# Altium project P3_MP3_Player.PrjPcb (part 2 of 2)

## Sheet 04_Audio.SchDoc
size A4; SheetNumber: 4; SheetTotal: 6
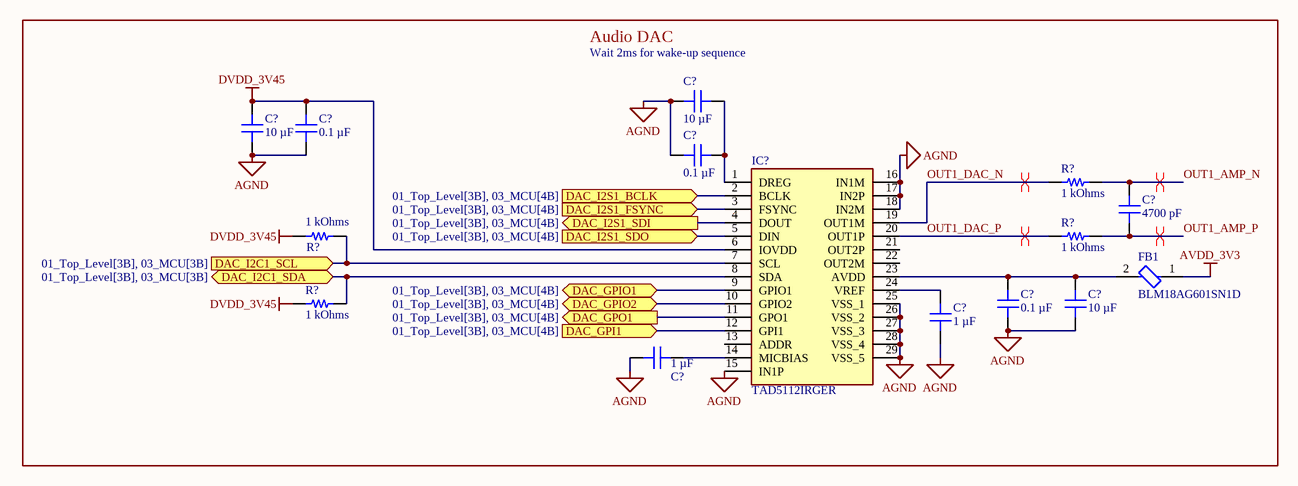
[diagram p4: 04_Audio.SchDoc]

### Parts
(Parts that share a designator on the sheet are numbered #1, #2 ... from top to bottom, then left to right.)
C?#9  10 µF  [CAP 0805_2012]
C?#10  10 µF  [CAP 0805_2012]
C?#11  0.1 µF  [CAP 0402_1005]
C?#12  0.1 µF  [CAP 0402_1005]
C?#13  4700 pF  [CAP 0402_1005]
C?#14  0.1 µF  [CAP 0402_1005]
C?#15  10 µF  [CAP 0805_2012]
C?#16  1 µF  [CAP 0603_1608]
C?#17  1 µF  [CAP 0603_1608]
FB1  BLM18AG601SN1D  [FP-BLM18-0_15-t0_8-MFG]
IC?#2  TAD5112IRGER  [TAD5112IRGER]
R?#3  1 kOhms  [RES 0402_1005]
R?#4  1 kOhms  [RES 0402_1005]
R?#5  1 kOhms  [RES 0402_1005]
R?#6  1 kOhms  [RES 0402_1005]

### Ports
DAC_GPI1 (in, see 01_Top_Level[3B], 03_MCU[4B]), DAC_GPIO1 (bidir, see 01_Top_Level[3B], 03_MCU[4B]), DAC_GPIO2 (bidir, see 01_Top_Level[3B], 03_MCU[4B]), DAC_GPO1 (out, see 01_Top_Level[3B], 03_MCU[4B]), DAC_I2C1_SCL (in, see 01_Top_Level[3B], 03_MCU[3B]), DAC_I2C1_SDA (bidir, see 01_Top_Level[3B], 03_MCU[3B]), DAC_I2S1_BCLK (in, see 01_Top_Level[3B], 03_MCU[4B]), DAC_I2S1_FSYNC (in, see 01_Top_Level[3B], 03_MCU[4B]), DAC_I2S1_SDI (out, see 01_Top_Level[3B], 03_MCU[4B]), DAC_I2S1_SDO (in, see 01_Top_Level[3B], 03_MCU[4B])

### Nets
AGND: C?#9.2 C?#10.2 C?#11.1 C?#12.1 C?#14.1 C?#15.2 C?#16.1 C?#17.2 IC?#2.15(IN1P) IC?#2.16(IN1M) IC?#2.17(IN2P) IC?#2.18(IN2M) IC?#2.25(VSS_1) IC?#2.26(VSS_2) IC?#2.27(VSS_3) IC?#2.28(VSS_4) IC?#2.29(VSS_5)
AVDD_3V3: FB1.1
DVDD_3V45: C?#10.1 C?#11.2 IC?#2.6(IOVDD) R?#4.2 R?#6.2
OUT1_AMP_N: C?#13.2 R?#3.2
OUT1_AMP_P: C?#13.1 R?#5.2
OUT1_DAC_N: IC?#2.19(OUT1M) R?#3.1
OUT1_DAC_P: IC?#2.20(OUT1P) R?#5.1
NetC?#9_1: C?#9.1 C?#12.2 IC?#2.1(DREG)
NetC?#14_2: C?#14.2 C?#15.1 FB1.2 IC?#2.23(AVDD)
NetC?#16_2: C?#16.2 IC?#2.24(VREF)
NetC?#17_1: C?#17.1 IC?#2.14(MICBIAS)
NetIC?#1_50: IC?#2.3(FSYNC) ; port DAC_I2S1_FSYNC
NetIC?#1_51: IC?#2.12(GPI1) ; port DAC_GPI1
NetIC?#1_52: IC?#2.11(GPO1) ; port DAC_GPO1
NetIC?#1_53: IC?#2.10(GPIO2) ; port DAC_GPIO2
NetIC?#1_54: IC?#2.9(GPIO1) ; port DAC_GPIO1
NetIC?#1_55: IC?#2.2(BCLK) ; port DAC_I2S1_BCLK
NetIC?#1_56: IC?#2.4(DOUT) ; port DAC_I2S1_SDI
NetIC?#1_57: IC?#2.5(DIN) ; port DAC_I2S1_SDO
NetIC?#1_61: IC?#2.7(SCL) R?#4.1 ; port DAC_I2C1_SCL
NetIC?#1_62: IC?#2.8(SDA) R?#6.1 ; port DAC_I2C1_SDA

Not connected (* = marked no-connect by the designer): IC?#2 13(ADDR) 21(OUT2P) 22(OUT2M)

### Layout directives
differential pair: OUT1_AMP_N, OUT1_AMP_P, OUT1_DAC_N, OUT1_DAC_P

### Notes on the sheet
- Audio DAC
- (near C?#9) Wait 2ms for wake-up sequence

### Library data of the parts
C?#9 C?#10 C?#15 = CL21A106KOQNNNG: CAP CER 10UF 16V X5R 0805; manufacturer: Samsung Electro-Mechanics; Tolerance: ±10%; Part Number: CL21A106KOQNNNG; Capacitance: 10 µF; Applications: General Purpose; componentlink1description: Datasheet; componentlink1url: http://www.samsungsem.com/kr/support/product-search/mlcc/CL21A106KOQNNNG.jsp; componentlink2description: DigiKey Link; componentlink2url: https://www.digikey.com/en/products/detail/samsung-electro-mechanics/CL21A106KOQNNNG/3894417; Device Package: 0805 (2012 Metric); lastupdated: 4/6/2026 7:33:06 PM; Lifecycle Status: Active; Minimum Order: 1; Mounting Type: Surface Mount, MLCC; Operating Temperature: -55°C ~ 85°C; Package / Case: 0805 (2012 Metric); packaging: TapeAndReel; partid: 39874; Part Status: Active; price: 0.01; series: CL; Size / Dimension: 0.079" L x 0.049" W (2.00mm x 1.25mm); Supplier 1: DigiKey; Supplier Part Number 1: 1276-6455-1-ND; Temperature Coefficient: X5R; Thickness (Max): 0.055" (1.40mm); value: 10 µF; Voltage - Rated: 16V
C?#11 C?#12 C?#14 = EMF105B7104KVHF: CAP CER 0.1UF 16V X7R 0402; manufacturer: Taiyo Yuden; Tolerance: ±10%; Part Number: EMF105B7104KVHF; Capacitance: 0.1 µF; Applications: Automotive, SMPS Filtering; componentlink1description: Datasheet; componentlink1url: https://ds.yuden.co.jp/TYCOMPAS/ut/detail?pn=EMF105B7104KVHF&u=M; componentlink2description: DigiKey Link; componentlink2url: https://www.digikey.com/en/products/detail/taiyo-yuden/EMF105B7104KVHF/10379129; Device Package: 0402 (1005 Metric); lastupdated: 4/6/2026 7:11:11 PM; Lifecycle Status: Active; Minimum Order: 1; Mounting Type: Surface Mount, MLCC; Operating Temperature: -55°C ~ 125°C; Package / Case: 0402 (1005 Metric); packaging: TapeAndReel; partid: 1868; Part Status: Active; price: 0.01; Ratings: AEC-Q200; series: M; Size / Dimension: 0.039" L x 0.020" W (1.00mm x 0.50mm); Supplier 1: DigiKey; Supplier Part Number 1: 587-6563-1-ND; Temperature Coefficient: X7R; Thickness (Max): 0.022" (0.55mm); value: 0.1 µF; Voltage - Rated: 16V
C?#13 = 885012205029: CAP CER 4700PF 16V X7R 0402; manufacturer: Würth Elektronik; Tolerance: ±10%; Part Number: 885012205029; Capacitance: 4700 pF; Applications: General Purpose; componentlink1description: Datasheet; componentlink1url: https://katalog.we-online.de/pbs/datasheet/885012205029.pdf; componentlink2description: DigiKey Link; componentlink2url: https://www.digikey.com/en/products/detail/würth-elektronik/885012205029/5453379; Device Package: 0402 (1005 Metric); lastupdated: 4/6/2026 7:11:09 PM; Lifecycle Status: Active; Minimum Order: 1; Mounting Type: Surface Mount, MLCC; Operating Temperature: -55°C ~ 125°C; Package / Case: 0402 (1005 Metric); packaging: TapeAndReel; partid: 2028; Part Status: Active; price: 0.01; series: WCAP-CSGP; Size / Dimension: 0.039" L x 0.020" W (1.00mm x 0.50mm); Supplier 1: DigiKey; Supplier Part Number 1: 732-7524-1-ND; Temperature Coefficient: X7R; Thickness (Max): 0.022" (0.55mm); value: 4700 pF; Voltage - Rated: 16V
C?#16 C?#17 = CL10A105KA8NFNC: CAP CER 1UF 25V X5R 0603; manufacturer: Samsung Electro-Mechanics; Tolerance: ±10%; Part Number: CL10A105KA8NFNC; Capacitance: 1 µF; Applications: General Purpose; componentlink1description: Datasheet; componentlink1url: http://www.samsungsem.com/kr/support/product-search/mlcc/CL10A105KA8NFNC.jsp; componentlink2description: DigiKey Link; componentlink2url: https://www.digikey.com/en/products/detail/samsung-electro-mechanics/CL10A105KA8NFNC/3887517; Device Package: 0603 (1608 Metric); lastupdated: 4/6/2026 7:23:08 PM; Lifecycle Status: Active; Minimum Order: 1; Mounting Type: Surface Mount, MLCC; Operating Temperature: -55°C ~ 85°C; Package / Case: 0603 (1608 Metric); packaging: TapeAndReel; partid: 14268; Part Status: Active; price: 0.01; series: CL; Size / Dimension: 0.063" L x 0.031" W (1.60mm x 0.80mm); Supplier 1: DigiKey; Supplier Part Number 1: 1276-1859-1-ND; Temperature Coefficient: X5R; Thickness (Max): 0.035" (0.90mm); value: 1 µF; Voltage - Rated: 25V
FB1 = CMP-0686-00436-3: Chip Ferrite Bead, 0603, 600Ω @ 100MHz, 0.38Ω, 25%, 500mA; Number of Lines: 1; Impedance: 600R; DC Resistance (DCR): 380mR; Material: Steel; Shielding: Unshielded; Max DC Current: 500mA; Termination: SMD/SMT; Military Standard: Not; Number of Circuits: 1; Min Operating Temperature: -55°C; Case Code (Imperial): 0603; Width: 0.8mm; Current Rating: 500mA; Lead Free: Lead Free; Packaging: Tape and Reel; Frequency: 100MHz; Max Operating Temperature: 125°C; DC Current: 500mA; REACH SVHC: No SVHC; Case/Package: 0603; Package Quantity: 1; Height: 0.8mm; Number of Pins: 2; Depth: 0.8mm; Test Frequency: 100MHz; Case Code (Metric): 1608; Tolerance: 25%; Core Material: Ferrite; Weight: 7.1E-05oz; Max Current Rating: 500mA; Radiation Hardening: No; Length: 1.6mm; RoHS Compliant: Yes
IC?#2 = TAD5112IRGER: Integrated Circuit; Manufacturer_Name: Texas Instruments; Datasheet Link: https://www.ti.com/lit/gpn/tad5112; Height: 1mm; Manufacturer_Part_Number: TAD5112IRGER; DigiKey Link: https://www.digikey.ca/en/products/detail/texas-instruments/TAD5112IRGER/26251062
R?#3-R?#6 = RC0402FR-071KL: RES 1K OHM 1% 1/16W 0402; Manufacturer: Yageo; Power (Watts): 0.063W, 1/16W; Temperature Coefficient: ±100ppm/°C; Part Number: RC0402FR-071KL; Value: 1 kOhms; ComponentLink1Description: Datasheet; ComponentLink1URL: https://www.yageo.com/upload/media/product/productsearch/datasheet/rchip/PYu-RC_Group_51_RoHS_L_10.pdf; ComponentLink2Description: DigiKey Link; ComponentLink2URL: https://www.digikey.com/en/products/detail/yageo/RC0402FR-071KL/726513; Composition: Thick Film; Device Package: 0402 (1005 Metric); Features: Moisture Resistant; Height - Seated (Max): 0.016" (0.40mm); LastUpdated: 4/6/2026 7:41:07 PM; Lifecycle Status: Active; Minimum Order: 1; Number of Terminations: 2; Operating Temperature: -55°C ~ 155°C; Package / Case: 0402 (1005 Metric); Packaging: CutTape; PartId: 17596; Part Status: Active; Price: 0.01; Resistance: 1 kOhms; Series: RC_L; Size / Dimension: 0.039" L x 0.020" W (1.00mm x 0.50mm); Supplier 1: DigiKey; Supplier Part Number 1: 311-1.00KLRCT-ND; Supplier Device Package: 0402; Tolerance: ±1%

## Sheet 06_Memory.SchDoc
size A4; SheetNumber: 6; SheetTotal: 6
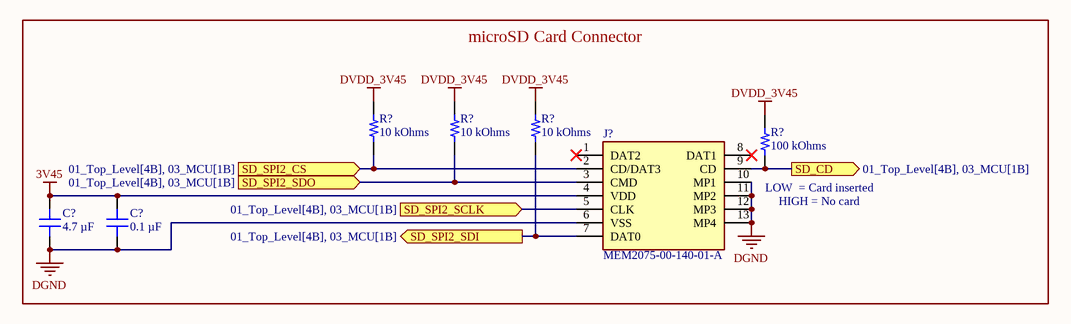
[diagram p5: 06_Memory.SchDoc]

### Parts
(Parts that share a designator on the sheet are numbered #1, #2 ... from top to bottom, then left to right.)
C?#18  4.7 µF  [CAP 0805_2012]
C?#19  0.1 µF  [CAP 0402_1005]
J?  MEM2075-00-140-01-A  [MEM20750014001A]
R?#7  10 kOhms  [RES 0402_1005]
R?#8  10 kOhms  [RES 0402_1005]
R?#9  10 kOhms  [RES 0402_1005]
R?#10  100 kOhms  [RES 0402_1005]

### Ports
SD_CD (out, see 01_Top_Level[4B], 03_MCU[1B]), SD_SPI2_CS (in, see 01_Top_Level[4B], 03_MCU[1B]), SD_SPI2_SCLK (in, see 01_Top_Level[4B], 03_MCU[1B]), SD_SPI2_SDI (out, see 01_Top_Level[4B], 03_MCU[1B]), SD_SPI2_SDO (in, see 01_Top_Level[4B], 03_MCU[1B])

### Nets
3V45: C?#18.2 C?#19.1 J?.4(VDD)
DGND: C?#18.1 C?#19.2 J?.6(VSS) J?.10(MP1) J?.11(MP2) J?.12(MP3) J?.13(MP4)
DVDD_3V45: R?#7.2 R?#8.2 R?#9.2 R?#10.2
NetIC?#1_34: J?.5(CLK) ; port SD_SPI2_SCLK
NetIC?#1_35: J?.7(DAT0) R?#9.1 ; port SD_SPI2_SDI
NetIC?#1_36: J?.3(CMD) R?#8.1 ; port SD_SPI2_SDO
NetIC?#1_37: J?.9(CD) R?#10.1 ; port SD_CD
NetIC?#1_38: J?.2(CD/DAT3) R?#7.1 ; port SD_SPI2_CS

Not connected (* = marked no-connect by the designer): J? 1(DAT2)* 8(DAT1)*

### Notes on the sheet
- microSD Card Connector
- LOW  = Card inserted
- HIGH = No card

### Library data of the parts
C?#18 = MSAST21GAB5475KTNA01: CAP CER 4.7UF 25V X5R 0805; manufacturer: Taiyo Yuden; Tolerance: ±10%; Part Number: MSAST21GAB5475KTNA01; Capacitance: 4.7 µF; Applications: SMPS Filtering; componentlink1description: Datasheet; componentlink1url: https://mm.digikey.com/Volume0/opasdata/d220001/medias/docus/5731/MSR01_e.pdf; componentlink2description: DigiKey Link; componentlink2url: https://www.digikey.com/en/products/detail/taiyo-yuden/MSAST21GAB5475KTNA01/16659772; Device Package: 0805 (2012 Metric); lastupdated: 4/6/2026 7:29:35 PM; Lifecycle Status: Active; Minimum Order: 1; Mounting Type: Surface Mount, MLCC; Operating Temperature: -55°C ~ 85°C; Package / Case: 0805 (2012 Metric); packaging: TapeAndReel; partid: 73602; price: 0.02; series: MSAS; Size / Dimension: 0.079" L x 0.049" W (2.00mm x 1.25mm); Supplier 1: DigiKey; Supplier Part Number 1: 587-MSAST21GAB5475KTNA01CT-ND; Temperature Coefficient: X5R; Thickness (Max): 0.055" (1.40mm); value: 4.7 µF; Voltage - Rated: 25V
C?#19 = EMF105B7104KVHF: as C?#11 on sheet 04_Audio; Part Number: EMF105B7104KVHF; Capacitance: 0.1 µF; Applications: Automotive, SMPS Filtering; componentlink1description: Datasheet; componentlink1url: https://ds.yuden.co.jp/TYCOMPAS/ut/detail?pn=EMF105B7104KVHF&u=M; componentlink2description: DigiKey Link; componentlink2url: https://www.digikey.com/en/products/detail/taiyo-yuden/EMF105B7104KVHF/10379129; Device Package: 0402 (1005 Metric); lastupdated: 4/6/2026 7:11:11 PM; Lifecycle Status: Active; Minimum Order: 1; Mounting Type: Surface Mount, MLCC; Operating Temperature: -55°C ~ 125°C; Package / Case: 0402 (1005 Metric); packaging: TapeAndReel; partid: 1868; Part Status: Active; price: 0.01; Ratings: AEC-Q200; series: M; Size / Dimension: 0.039" L x 0.020" W (1.00mm x 0.50mm); Supplier 1: DigiKey; Supplier Part Number 1: 587-6563-1-ND; Temperature Coefficient: X7R; Thickness (Max): 0.022" (0.55mm); value: 0.1 µF; Voltage - Rated: 16V
J? = MEM2075-00-140-01-A: Connector; Manufacturer_Name: GCT (GLOBAL CONNECTOR TECHNOLOGY); Datasheet Link: http://www.farnell.com/cad/2606866.pdf; Height: 1.45mm; Manufacturer_Part_Number: MEM2075-00-140-01-A; Mouser Part Number: 640-MEM20750014001A; Mouser Price/Stock: https://www.mouser.co.uk/ProductDetail/GCT/MEM2075-00-140-01-A?qs=KUoIvG%2F9IlZvfWpeERlq3Q%3D%3D; DigiKey Link: https://www.digikey.ca/en/products/detail/gct/MEM2075-00-140-01-A/9859614
R?#7-R?#9 = CRCW040210K0FKEE: RES SMD 10K OHM 1% 1/16W 0402; Manufacturer: Vishay Dale; Power (Watts): 0.063W, 1/16W; Temperature Coefficient: ±100ppm/°C; Part Number: CRCW040210K0FKEE; Value: 10 kOhms; ComponentLink1Description: Datasheet; ComponentLink1URL: http://www.vishay.com/docs/20035/dcrcwe3.pdf; ComponentLink2Description: DigiKey Link; ComponentLink2URL: https://www.digikey.com/en/products/detail/vishay-dale/CRCW040210K0FKEE/5069897; Composition: Thick Film; Device Package: 0402 (1005 Metric); Features: Automotive AEC-Q200; Height - Seated (Max): 0.016" (0.40mm); LastUpdated: 2/9/2024 8:30:20 PM; Lifecycle Status: Active; Minimum Order: 1; Number of Terminations: 2; Operating Temperature: -55°C ~ 155°C; Package / Case: 0402 (1005 Metric); Packaging: CutTape; PartId: 3471; Part Status: Active; Price: 0.01; Ratings: AEC-Q200; Resistance: 10 kOhms; Series: CRCW; Size / Dimension: 0.039" L x 0.020" W (1.00mm x 0.50mm); Supplier 1: DigiKey; Supplier Part Number 1: 541-2954-1-ND; Supplier Device Package: 0402; Tolerance: ±1%
R?#10 = RT0402FRE07100KL: RES SMD 100K OHM 1% 1/16W 0402; Manufacturer: Yageo; Power (Watts): 0.063W, 1/16W; Temperature Coefficient: ±50ppm/°C; Part Number: RT0402FRE07100KL; Value: 100 kOhms; ComponentLink1Description: Datasheet; ComponentLink1URL: https://www.yageo.com/upload/media/product/productsearch/datasheet/rchip/PYu-RT_1-to-0.01_RoHS_L_11.pdf; ComponentLink2Description: DigiKey Link; ComponentLink2URL: https://www.digikey.com/en/products/detail/yageo/RT0402FRE07100KL/1071698; Composition: Thin Film; Device Package: 0402 (1005 Metric); Height - Seated (Max): 0.014" (0.35mm); LastUpdated: 4/6/2026 7:41:17 PM; Lifecycle Status: Active; Minimum Order: 1; Number of Terminations: 2; Operating Temperature: -55°C ~ 155°C; Package / Case: 0402 (1005 Metric); Packaging: TapeAndReel; PartId: 3190; Part Status: Active; Price: 0.01; Resistance: 100 kOhms; Series: RT; Size / Dimension: 0.039" L x 0.020" W (1.00mm x 0.50mm); Supplier 1: DigiKey; Supplier Part Number 1: YAG2307CT-ND; Supplier Device Package: 0402; Tolerance: ±1%

## Nets that join several sheets
AGND: 02_Power (C204.1), 04_Audio (17 pins)
AVDD_3V3: 02_Power (C204.2 U201.1), 04_Audio (FB1.1)
DGND: 03_MCU (19 pins), 02_Power (30 pins), 05_Display (6 pins), 06_Memory (7 pins)
DVDD_3V3: 02_Power (C?#8.2 U?.1), 05_Display (C503.1 J500.8 R500.1 R501.1)
DVDD_3V45: 03_MCU (19 pins), 02_Power (12 pins), 05_Display (C502.1 J500.5), 04_Audio (5 pins), 06_Memory (R?#7.2 R?#8.2 R?#9.2 R?#10.2)
D_OUT_N: 03_MCU (IC?#1.44), 02_Power (D200.4)
D_OUT_P: 03_MCU (IC?#1.45), 02_Power (D200.6)
NetD202_C: 03_MCU (IC?#1.26), 02_Power (D202.C U200.8)
NetD203_C: 03_MCU (IC?#1.27), 02_Power (D203.C U200.5)
NetIC?#1_34: 03_MCU (IC?#1.34), 06_Memory (J?.5)
NetIC?#1_35: 03_MCU (IC?#1.35), 06_Memory (J?.7 R?#9.1)
NetIC?#1_36: 03_MCU (IC?#1.36), 06_Memory (J?.3 R?#8.1)
NetIC?#1_37: 03_MCU (IC?#1.37), 06_Memory (J?.9 R?#10.1)
NetIC?#1_38: 03_MCU (IC?#1.38), 06_Memory (J?.2 R?#7.1)
NetIC?#1_50: 03_MCU (IC?#1.50), 04_Audio (IC?#2.3)
NetIC?#1_51: 03_MCU (IC?#1.51), 04_Audio (IC?#2.12)
NetIC?#1_52: 03_MCU (IC?#1.52), 04_Audio (IC?#2.11)
NetIC?#1_53: 03_MCU (IC?#1.53), 04_Audio (IC?#2.10)
NetIC?#1_54: 03_MCU (IC?#1.54), 04_Audio (IC?#2.9)
NetIC?#1_55: 03_MCU (IC?#1.55), 04_Audio (IC?#2.2)
NetIC?#1_56: 03_MCU (IC?#1.56), 04_Audio (IC?#2.4)
NetIC?#1_57: 03_MCU (IC?#1.57), 04_Audio (IC?#2.5)
NetIC?#1_61: 03_MCU (IC?#1.61), 04_Audio (IC?#2.7 R?#4.1)
NetIC?#1_62: 03_MCU (IC?#1.62), 04_Audio (IC?#2.8 R?#6.1)
SCL: 03_MCU (IC?#1.29), 05_Display (J500.10 R500.2)
SDA: 03_MCU (IC?#1.33), 05_Display (J500.11 R501.2)
~RES: 03_MCU (IC?#1.28), 05_Display (J500.9)